# Altium schematic sheet RF-Pi+Carrier+Board+v1.schdoc
size 215 x 221 mm
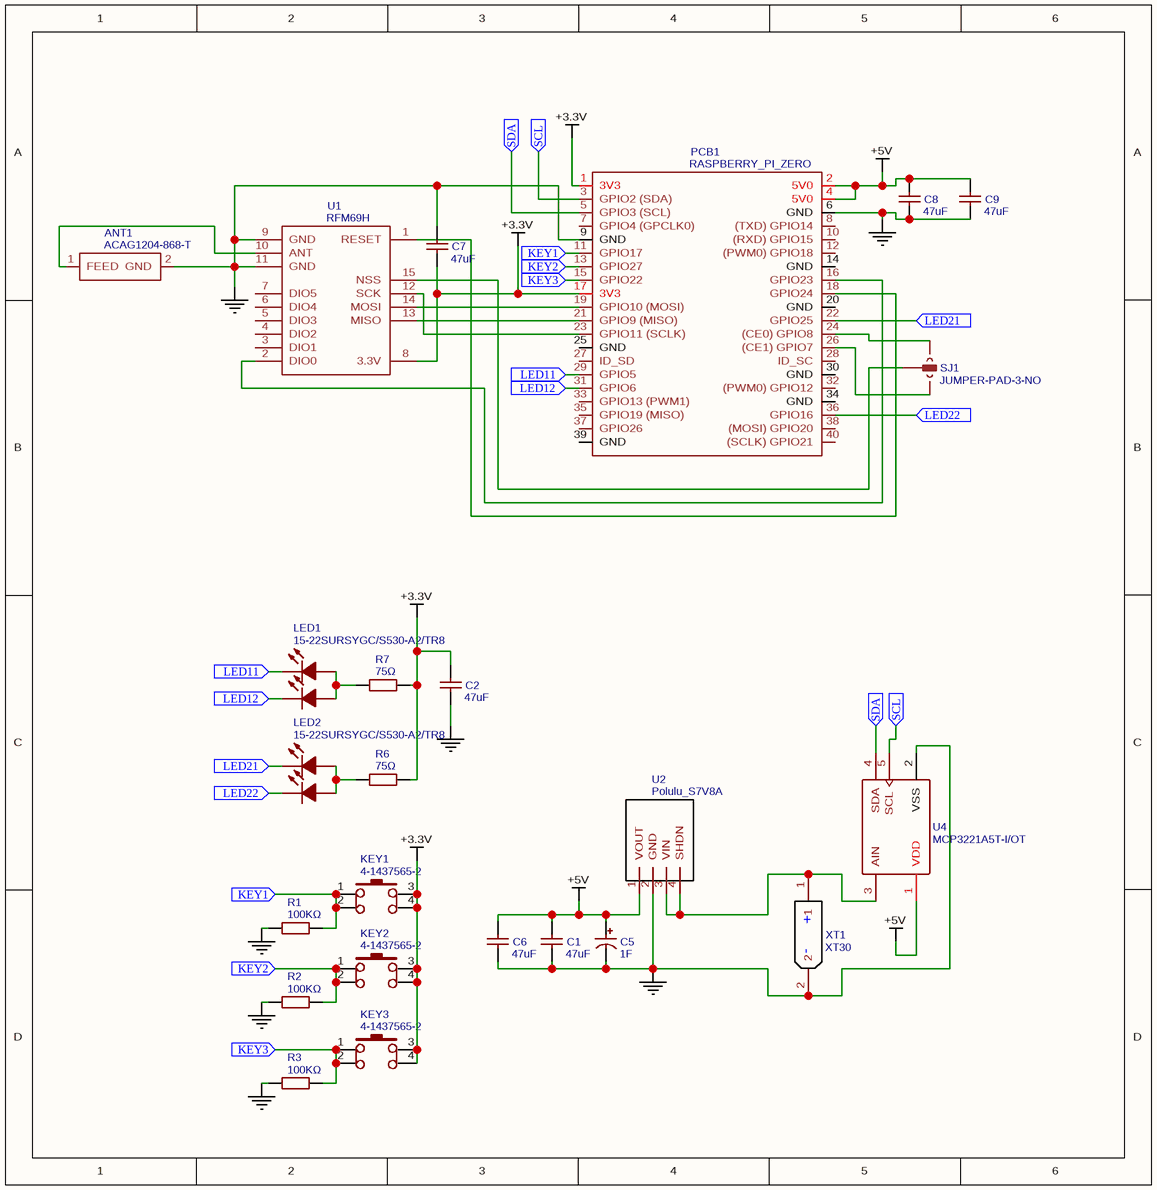
[diagram p0: RF-Pi+Carrier+Board+v1.schdoc]

## Parts
ANT1  ACAG1204-868-T  [ANTENNA-CHIP-12X4MM]
C1  47uF  [1206]
C2  47uF  [1206]
C5  1F  [SE-5R5-D105VYH]
C6  47uF  [1206]
C7  47uF  [1206]
C8  47uF  [1206]
C9  47uF  [1206]
KEY1  4-1437565-2  [KEY-6.0*6.0]
KEY2  4-1437565-2  [KEY-6.0*6.0]
KEY3  4-1437565-2  [KEY-6.0*6.0]
LED1  15-22SURSYGC/S530-A2/TR8  [1206X2]
LED2  15-22SURSYGC/S530-A2/TR8  [1206X2]
PCB1  RASPBERRY_PI_ZERO  [RASPBERRY PI ZERO (FACE UP) OUTLINE]
R1  100KΩ  [1206]
R2  100KΩ  [1206]
R3  100KΩ  [1206]
R6  75Ω  [1206]
R7  75Ω  [1206]
SJ1  JUMPER-PAD-3-NO  [JUMPER_SOLDER]
U1  RFM69H  [RFM69W-XXXS2]
U2  Polulu_S7V8A  [POLULU_S7V8A_SMD]
U4  MCP3221A5T-I/OT  [SOT-23-5]
XT1  XT30  [XT30 BY BUCK]

## Ports
KEY1, KEY2, KEY3, LED11, LED12, LED21, LED22, SCL, SDA

## Nets
+3.3V: C2.2 C7.1 KEY1.3 KEY1.4 KEY2.3 KEY2.4 KEY3.3 KEY3.4 PCB1.1(3V3) PCB1.17(3V3) R6.2 R7.2 U1.8(3.3V)
+5V: C1.2 C5.1 C6.2 C8.2 C9.2 PCB1.2(5V0) PCB1.4(5V0) U2.1(VOUT) U4.1(VDD)
GND: ANT1.2(GND) C1.1 C2.1 C5.2 C6.1 C7.2 C8.1 C9.1 PCB1.6(GND) PCB1.9(GND) R1.1 R2.1 R3.1 U1.9(GND) U1.11(GND) U2.2(GND) U4.2(VSS) XT1.2
KEY1: KEY1.1 KEY1.2 PCB1.11(GPIO17) R1.2 ; port KEY1
KEY2: KEY2.1 KEY2.2 PCB1.13(GPIO27) R2.2 ; port KEY2
KEY3: KEY3.1 KEY3.2 PCB1.15(GPIO22) R3.2 ; port KEY3
LED11: LED1.2(K) PCB1.29(GPIO5) ; port LED11
LED12: LED1.4(K) PCB1.31(GPIO6) ; port LED12
LED21: LED2.2(K) PCB1.22(GPIO25) ; port LED21
LED22: LED2.4(K) PCB1.36(GPIO16) ; port LED22
SCL: PCB1.3(GPIO2_(SDA)) U4.5(SCL) ; port SCL
SDA: PCB1.5(GPIO3_(SCL)) U4.4(SDA) ; port SDA
NetANT1_1: ANT1.1(FEED) U1.10(ANT)
NetLED1_1: LED1.1(A) LED1.3(A) R7.1
NetLED2_1: LED2.1(A) LED2.3(A) R6.1
NetPCB1_16: PCB1.16(GPIO23) U1.2(DIO0)
NetPCB1_18: PCB1.18(GPIO24) U1.1(RESET)
NetPCB1_19: PCB1.19(GPIO10_(MOSI)) U1.14(MOSI)
NetPCB1_21: PCB1.21(GPIO9_(MISO)) U1.13(MISO)
NetPCB1_23: PCB1.23(GPIO11_(SCLK)) U1.12(SCK)
NetPCB1_24: PCB1.24((CE0)_GPIO8) SJ1.1
NetPCB1_26: PCB1.26((CE1)_GPIO7) SJ1.3
NetSJ1_2: SJ1.2 U1.15(NSS)
NetU2_3: U2.3(VIN) U2.4(SHDN) U4.3(AIN) XT1.1

Not connected (* = marked no-connect by the designer): PCB1 7(GPIO4_(GPCLK0)) 8((TXD)_GPIO14) 10((RXD)_GPIO15) 12((PWM0)_GPIO18) 14(GND) 20(GND) 25(GND) 27(ID_SD) 28(ID_SC) 30(GND) 32((PWM0)_GPIO12) 33(GPIO13_(PWM1)) 34(GND) 35(GPIO19_(MISO)) 37(GPIO26) 38((MOSI)_GPIO20) 39(GND) 40((SCLK)_GPIO21); U1 3(DIO1) 4(DIO2) 5(DIO3) 6(DIO4) 7(DIO5)

## Notes on the sheet
- (in symbol XT30) +; -

## Library data of the parts
ANT1 = ACAG1204-868-T: description: 868 Ceramic Chip Antenna; Contributor: JUehV; BOM_Manufacturer Part: ACAG1204-868-T; BOM_Supplier: Mouser; spicePre: A; BOM_Supplier Part: ACAG1204-868-T
C1 C2 C6-C9 = 47uF: BOM_Manufacturer: FH; BOM_Manufacturer Part: 1206F476M100NT; nameAlias: Capacitance; BOM_Supplier: LCSC; spicePre: C; spiceSymbolName: 1206F476M100NT; BOM_Supplier Part: C30349
C5 = 1F: BOM_Manufacturer: KAMCAP; nameAlias: Capacitance; Contributor: LCSC; BOM_Supplier: LCSC; BOM_Manufacturer Part: SE-5R5-D105VYH; spicePre: C; spiceSymbolName: SE-5R5-D105VYH; BOM_Supplier Part: C118887
KEY1-KEY3 = 4-1437565-2: BOM_Manufacturer: TE Connectivity; BOM_Supplier: LCSC; BOM_Manufacturer Part: 4-1437565-2; spicePre: K; BOM_Supplier Part: C86487
LED1 LED2 = 15-22SURSYGC/S530-A2/TR8: BOM_Manufacturer: EVERLIGHT; Contributor: LCSC; BOM_Supplier: LCSC; BOM_Manufacturer Part: 15-22SURSYGC/S530-A2/TR8; spicePre: L; BOM_Supplier Part: C131251
PCB1 = RASPBERRY_PI_ZERO: description: Raspberry Pi Zero; sourceId: a8qICUO6o; timeStamp: 1464116511; BOM_Manufacturer Part: ?; spicePre: P
R1-R3 = 100KΩ: BOM_Manufacturer: UniOhm; BOM_Manufacturer Part: 1206W4J0104T5E; nameAlias: Value; BOM_Supplier: LCSC; spicePre: R; spiceSymbolName: 1206W4J0104T5E; BOM_Supplier Part: C25647
R6 R7 = 75Ω: BOM_Manufacturer: UniOhm; BOM_Manufacturer Part: 1206W4F750JT5E; nameAlias: Value; BOM_Supplier: LCSC; spicePre: R; spiceSymbolName: 1206W4F750JT5E; BOM_Supplier Part: C17987
SJ1 = JUMPER-PAD-3-NO: Contributor: SparkFun; BOM_Manufacturer Part: ?; spicePre: S
U1 = RFM69H: Contributor: SparkFun; BOM_Manufacturer Part: ?; spicePre: U; BOM_Supplier: Pollin; BOM_Supplier Part: https://www.pollin.de/p/funkmodul-hoperf-rfm69hcw-868-mhz-tx-rx-810307
U2 = Polulu_S7V8A: Contributor: JUehV; BOM_Supplier: Polulu; link: https://www.pololu.com/product/2842; BOM_Manufacturer Part: ?; spicePre: U; BOM_Supplier Part: 2118
U4 = MCP3221A5T-I/OT: BOM_Manufacturer: MICROCHIP; BOM_Supplier: LCSC; BOM_Manufacturer Part: MCP3221A5T-I/OT; image: //image.lceda.cn/szlcsc/C36310.jpg; spicePre: U; BOM_Supplier Part: C36310
XT1 = XT30: Contributor: 4bucks; BOM_Manufacturer Part: XT30; spicePre: X; BOM_Supplier: LCSC; BOM_Supplier Part: C99101